# EAGLE design motor_ctrl_pw_v1 (EAGLE 6.5.0)
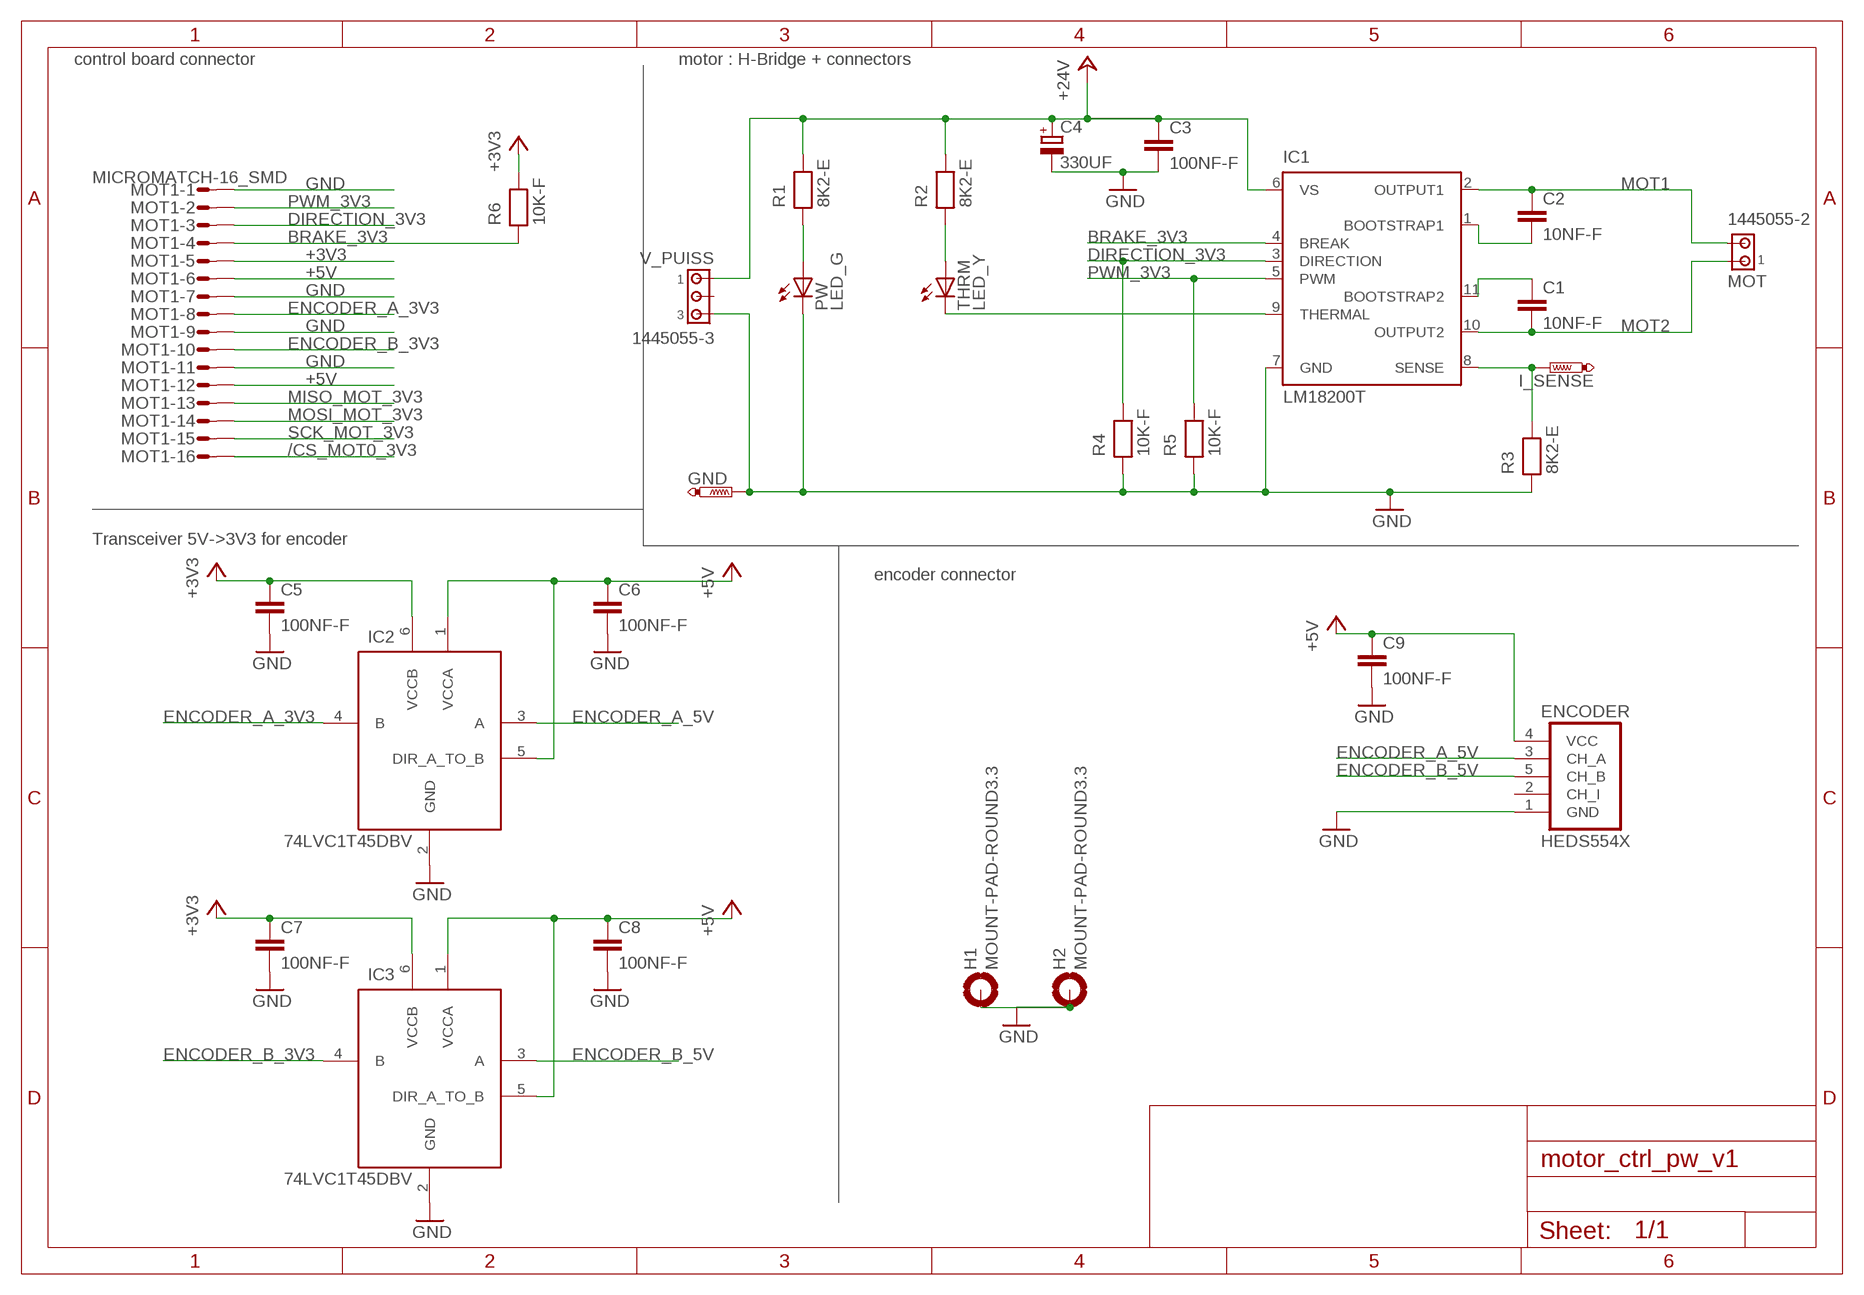
[diagram p0: schematic, sheet 1]

## Parts
C1  10NF-F  [C0603]
C2  10NF-F  [C0603]
C3  100NF-F  [C0603]
C4  330UF  [PANASONIC_G]
C5  100NF-F  [C0603]
C6  100NF-F  [C0603]
C7  100NF-F  [C0603]
C8  100NF-F  [C0603]
C9  100NF-F  [C0603]
ENCODER  HEDS554X  [22-05-1052]
GND  PTR1PAD1-13  [P1-13]
H1  MOUNT-PAD-ROUND3.3  [3,3-PAD]
H2  MOUNT-PAD-ROUND3.3  [3,3-PAD]
I_SENSE  PTR1PAD1-13  [P1-13]
IC1  LM18200T  [TO-220-11]
IC2  74LVC1T45DBV  [SOT23-6]
IC3  74LVC1T45DBV  [SOT23-6]
MOT  1445055-2  [1445055-2]
MOT1  MICROMATCH-16_SMD  [MICROMATCH-16_SMD]
PW  LED_G  [CHIP-LED0805]
R1  8K2-E  [R0805]
R2  8K2-E  [R0805]
R3  8K2-E  [R0805]
R4  10K-F  [R0603]
R5  10K-F  [R0603]
R6  10K-F  [R0603]
THRM  LED_Y  [CHIP-LED0805]
V_PUISS  1445055-3  [1445055-3]

## Nets
+3V3: C5.1 C7.1 IC2.6(VCCB) IC3.6(VCCB) MOT1.5 R6.2
+5V: C6.1 C8.1 C9.1 ENCODER.4(VCC) IC2.1(VCCA) IC2.5(DIR_A_TO_B) IC3.1(VCCA) IC3.5(DIR_A_TO_B) MOT1.6 MOT1.12
+24V: C3.1 C4.+ IC1.6(VS) R1.2 R2.2 V_PUISS.1
/CS_MOT0_3V3: MOT1.16
BRAKE_3V3: IC1.4(BREAK) MOT1.4 R6.1
DIRECTION_3V3: IC1.3(DIRECTION) MOT1.3 R4.2
ENCODER_A_3V3: IC2.4(B) MOT1.8
ENCODER_A_5V: ENCODER.3(CH_A) IC2.3(A)
ENCODER_B_3V3: IC3.4(B) MOT1.10
ENCODER_B_5V: ENCODER.5(CH_B) IC3.3(A)
GND: C3.2 C4.- C5.2 C6.2 C7.2 C8.2 C9.2 ENCODER.1(GND) GND.TP H1.B3,3(MOUNT) H2.B3,3(MOUNT) IC1.7(GND) IC2.2(GND) IC3.2(GND) MOT1.1 MOT1.7 MOT1.9 MOT1.11 PW.C R3.1 R4.1 R5.1 V_PUISS.3
MISO_MOT_3V3: MOT1.13
MOSI_MOT_3V3: MOT1.14
MOT1: C2.1 IC1.2(OUTPUT1) MOT.2
MOT2: C1.2 IC1.10(OUTPUT2) MOT.1
N$1: R2.1 THRM.A
N$2: I_SENSE.TP IC1.8(SENSE) R3.2
N$3: PW.A R1.1
N$4: IC1.9(THERMAL) THRM.C
N$5: C2.2 IC1.1(BOOTSTRAP1)
N$6: C1.1 IC1.11(BOOTSTRAP2)
PWM_3V3: IC1.5(PWM) MOT1.2 R5.2
SCK_MOT_3V3: MOT1.15
Unconnected: ENCODER.2(CH_I) V_PUISS.2

## Notes on the sheet
- control board connector | motor : H-Bridge + connectors
- Transceiver 5V->3V3 for encoder
- encoder connector

## Library data of the parts
C1 C2 = robotter_capacitor:10NF; MOUSER: 81-GCM188R71H103KA7D; RS: 723-4982; VALUE: 10nF 50V
C3 C5-C9 = robotter_capacitor:100NF; MOUSER: 81-GRM188F51H104ZA01; RS: 723-5534; VALUE: 100nF 50V
C4 = robotter_capacitor:330UF; MANUFACTURER: EEEFK1V331P; MOUSER: 667-EEE-FK1V331P; RS: 708-3475; VALUE: 330µF 35V
ENCODER = robotter_connector:HEDS554X; FARNELL: 9732594; MOUSER: 538-22-05-1052; RS: 687-7275; VALUE: 22-05-1052
GND I_SENSE = testpad:PTR1: TEST PIN
H1 H2 = holes:MOUNT-PAD-ROUND: MOUNTING PAD, round
IC1 = robotter_ic:LM18200T: 3A, 55V H-Bridge Motor Control SourcE: http://cache.national.com/ds/LM/LMD18200.pdf; FARNELL: 1468979; MOUSER: 926-LMD18200T/NOPB; RS: 534-4276
IC2 IC3 = robotter_ic:74LVC1T45; MOUSER: 595-SN74LVC1T45DBVT; RS: 662-8825
MOT = robotter_connector:1445055-2: Micro MATE-N-LOK Connectors grid 1.5 mm Source: ENG_CD_1445055_A.pdf; MOUSER: 571-2-1445055-2; RS: 495-9580
MOT1 = robotter_connector:MICROMATCH-16_SMD: MicroMaTch 16 FN : 1565592 / 8-215464-6 / 1-215464-6 Drawing Number C-215464 DDEController.pdf; MOUSER: 571-8-188275-6; RS: 739-1237
PW = robotter_diode:LED_; MOUSER: 859-LTST-C171GKT; RS: 692-0935; VALUE: GREEN
R1-R3 = robotter_resistor:8K2; MOUSER: 71-CRCW08058K20FKEB; RS: 679-1727
R4-R6 = robotter_resistor:10K; MOUSER: 652-CR0603-JW-103ELF; RS: 740-8899
THRM = robotter_diode:LED_; MOUSER: 859-LTST-C170YKT; RS: 692-0925; VALUE: YELLOW
V_PUISS = robotter_connector:1445055-3: Micro MATE-N-LOK Connectors grid 1.5 mm Source: ENG_CD_1445055_A.pdf; FARNELL: 1111119; MOUSER: 571-2-1445055-3; RS: 495-9596

## Board
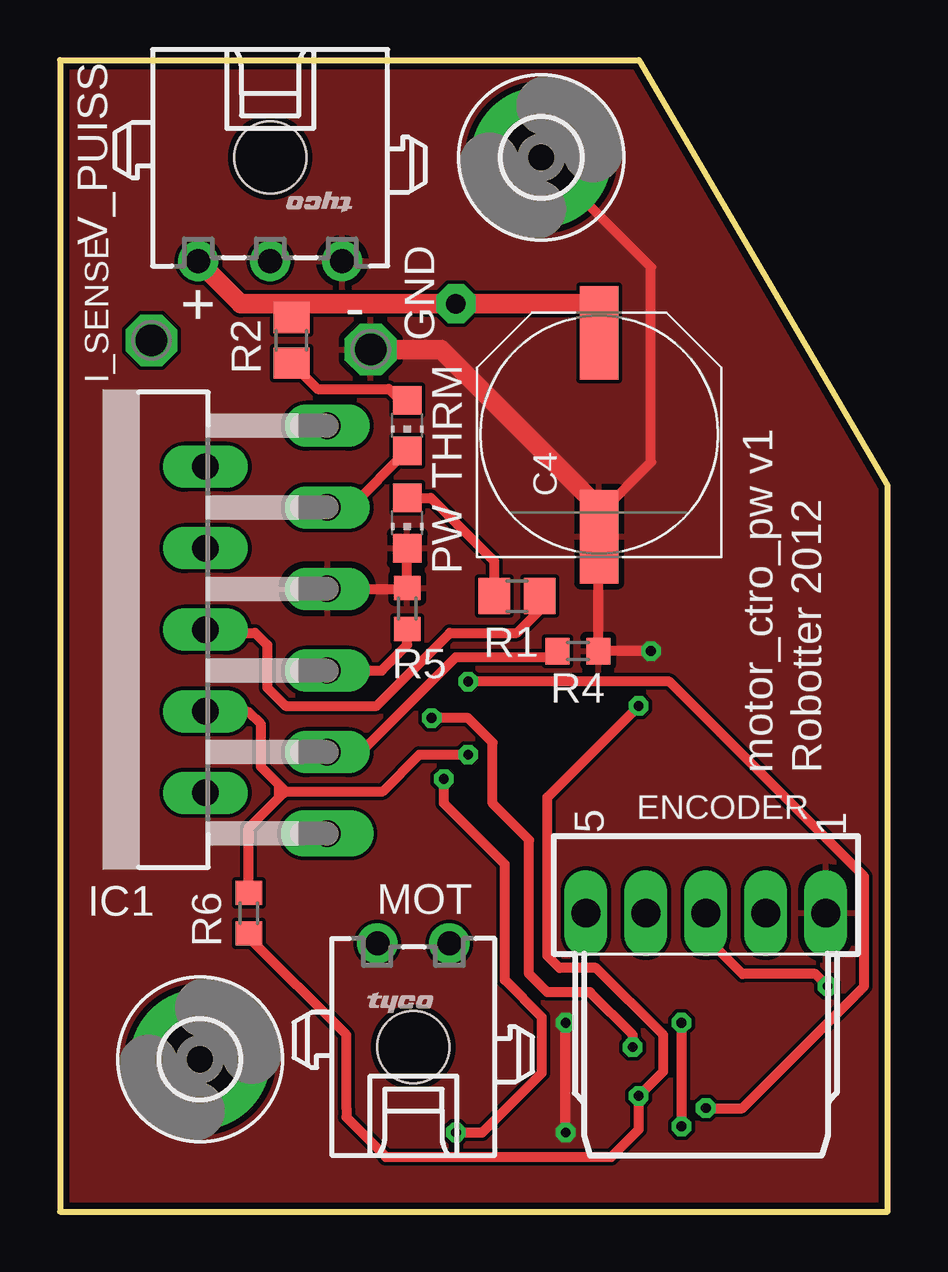
[diagram p1: board, top side]
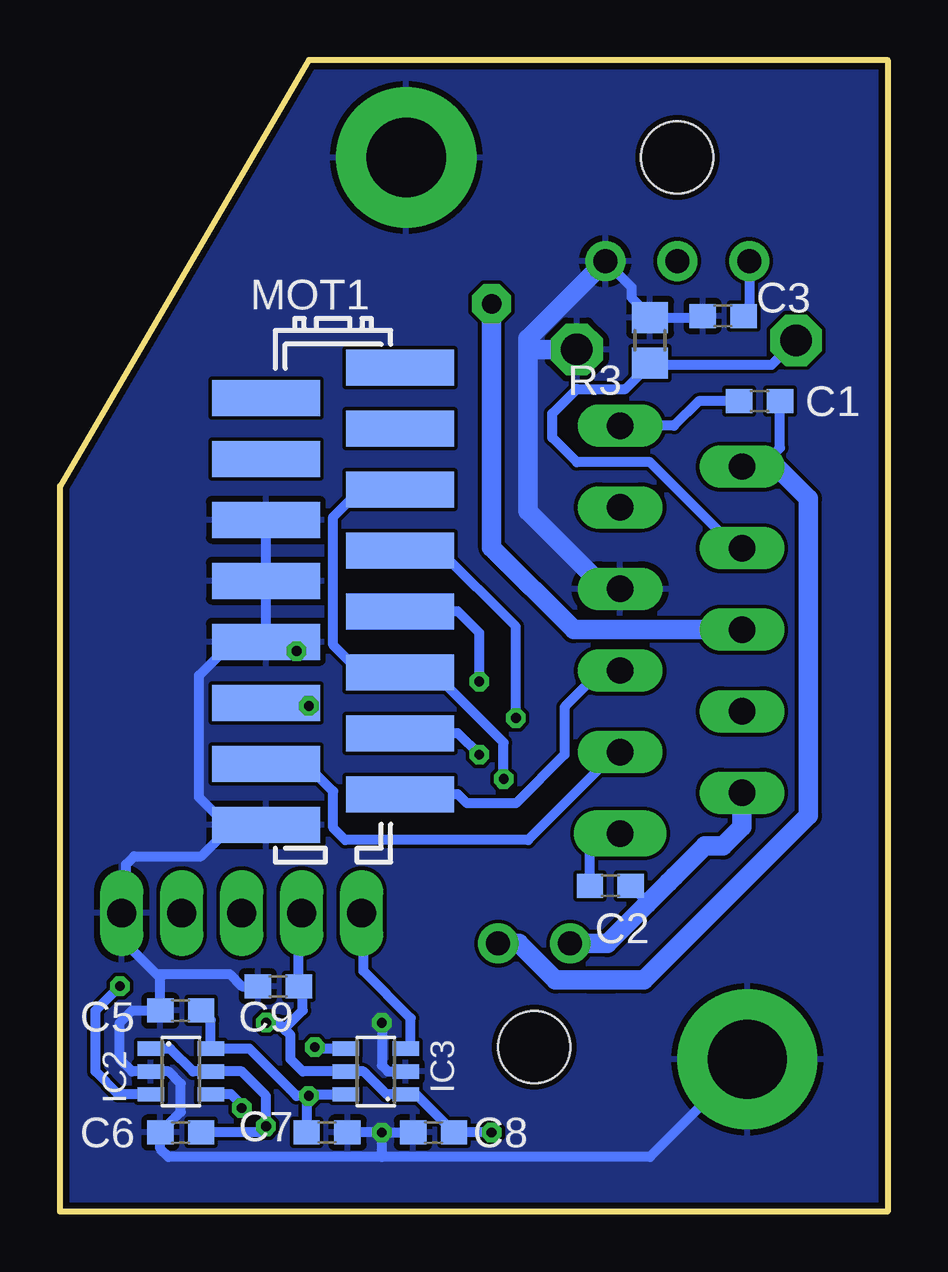
[diagram p2: board, bottom side, seen from below]

Size 34.5 x 48.01 mm. Coordinates in mm from the lower left corner, seen from the top.
Outline: 0,48 24.13,48 34.5,30.25 34.5,0 0,0 0,48.01
Copper layers (1*16): Top 0.035mm / dielectric 1.5mm / Bottom 0.035mm
Design rules "Fusion_eagle_rule_v1.1": minimum track width 6mil, minimum drill 12mil, track to track 6mil, track to pad 6mil, pad to pad 6mil, via to via 6mil, smd to smd 0mil, copper to edge 10mil, drill to drill 10mil, minimum pad ring 10mil, minimum via ring 6mil, stop-mask expansion 2mil, vias tented up to drill 100mil, thermal gap 10mil

### Footprints (pad centres in the part's own frame; a part is rotated, then mirrored left to right if it is on the bottom)
C0603 = smd 1.1 x 1: 1 -0.85,0; 2 0.85,0
PANASONIC_G = smd 3.9 x 1.6: + 4.25,0; - -4.25,0
22-05-1052 = drill 1.2 long: 1 5,0; 2 2.5,0; 3 0,0; 4 -2.5,0; 5 -5,0
P1-13 = drill 1.321 pad 2.159 octagon: TP 0,0
3,3-PAD = drill 3.3 pad 5.842: B3,3 0,0
TO-220-11 = drill 1.1 pad 1.93 long: 1 -8.5,-9.37 | drill 1.1 pad 1.778 long: 2 -6.8,-4.29; 3 -5.1,-9.37; 4 -3.4,-4.29; 5 -1.7,-9.37; 6 0,-4.29; 7 1.7,-9.37; 8 3.4,-4.29; 9 5.1,-9.37; 10 6.8,-4.29; 11 8.5,-9.37
SOT23-6 = smd 0.6 x 1.1: 1 -0.95,-1.25; 2 0,-1.25; 3 0.95,-1.25; 4 0.95,1.25; 5 0,1.25; 6 -0.95,1.25
1445055-2 = drill 1 pad 1.676: 1 1.5,4.32; 2 -1.5,4.32 | hole 3: 0,0
MICROMATCH-16_SMD = smd 1.5 x 4.5: 1 9.525,-2.794; 2 8.255,2.794; 3 6.985,-2.794; 4 5.715,2.794; 5 4.445,-2.794; 6 3.175,2.794; 7 1.905,-2.794; 8 0.635,2.794; 9 -0.635,-2.794; 10 -1.905,2.794; 11 -3.175,-2.794; 12 -4.445,2.794; 13 -5.715,-2.794; 14 -6.985,2.794; 15 -8.255,-2.794; 16 -9.525,2.794
CHIP-LED0805 = smd 1.2 x 1.2: A 0,-1.05; C 0,1.05
R0805 = smd 1.3 x 1.5: 1 -0.95,0; 2 0.95,0
R0603 = smd 1 x 1.1: 1 -0.85,0; 2 0.85,0
1445055-3 = drill 1 pad 1.676: 1 3,4.32; 2 0,4.32; 3 -3,4.32 | hole 3: 0,0

### Placement (x,y rotation side)
C1  5.33,33.78 0 bottom
C2  11.56,13.59 180 bottom
C3  6.86,37.34 180 bottom
C4  22.48,32.38 90 top
C5  29.46,8.38 180 bottom
C6  29.46,3.3 180 bottom
C7  23.37,3.3 0 bottom
C8  18.92,3.3 180 bottom
C9  25.4,9.4 180 bottom
ENCODER  26.92,12.45 0 top
GND  12.95,35.94 0 top
H1  20.07,43.94 0 top
H2  5.84,6.35 0 top
I_SENSE  3.81,36.32 0 top
IC1  1.78,24.26 90 top
IC2  29.46,5.84 270 bottom
IC3  21.34,5.84 90 bottom
MOT  14.73,6.86 0 top
MOT1  23.11,25.65 270 bottom
PW  14.48,28.7 180 top
R1  19.05,25.65 0 top
R2  9.65,36.32 90 top
R3  9.91,36.32 270 bottom
R4  21.59,23.37 180 top
R5  14.48,25.15 270 top
R6  7.87,12.45 270 top
THRM  14.48,32.77 180 top
V_PUISS  8.76,43.94 180 top

### Tracks (layer width: path | path; a pad name or v marks a point on that pad's centre or on a via)
+3V3  (via drill 0.41 pad 0.81)
  Top 0.406: R6.2 7.87,11.43 11.94,7.37 11.94,4.32 11.94,3.94 13.59,2.29 22.99,2.29 24.13,3.43 v24.13,4.83 25.15,5.84 25.15,7.37 22.35,10.16 20.83,10.16 20.32,10.67 20.32,17.27 v24.13,21.08
  Bottom 0.406: C5.1 28.21,7.98 IC2.6 26.6,6.79 24.64,4.83 v24.13,4.83 24.16,4.86 | v24.13,21.08 25.78,21.08 MOT1.5 | IC3.6 24.13,4.89 24.16,4.86 | C7.1 24.22,4.8 24.16,4.86
+5V  (via drill 0.41 pad 0.81)
  Top 0.406: v16,18.03 16,17.02 18.54,14.48 18.54,9.65 20.09,8.11 20.09,5.78 17.61,3.3 v16.51,3.3 | v25.91,7.87 v25.91,3.56
  Bottom 0.406: IC2.1 29.91,6.79 28.96,5.84 IC2.5 26.92,5.84 25.91,4.83 v25.91,3.56 26.16,3.3 C6.1 | MOT1.12 21.97,30.1 23.11,28.96 23.11,23.62 21.97,22.48 MOT1.6 18.92,22.48 16,19.56 v16,18.03 | ENCODER.4 24.55,12.32 C9.1 24.38,9.4 24.38,8.38 25.15,7.62 | 25.15,7.62 24.89,7.37 24.89,6.35 24.38,5.84 IC3.5 21.84,5.84 20.89,4.89 IC3.1 19.66,4.89 C8.1 v16.51,3.3 | 25.15,7.62 25.4,7.87 v25.91,7.87
+24V  (via drill 0.81 pad 1.63)
  Top 0.406: v16.51,37.85 16.26,38.1 | R1.2 20,25.08 19.05,24.13 16.26,24.13 13.21,21.08 9.4,21.08 8.64,21.84 8.64,23.62 8.13,24.13 6.2,24.13 IC1.6 | 9.91,37.34 9.91,37.59 9.65,37.85 | 10.16,37.85 10.16,37.78 R2.2
  Top 0.813: 9.53,37.85 9.65,37.85 10.16,37.85 v16.51,37.85 21.84,37.85 22.48,37.21 C4.+ | 9.53,37.85 7.54,37.85 V_PUISS.1 | 9.91,37.34 9.91,37.47 9.53,37.85
  Bottom 0.406: V_PUISS.1 5.76,37.58 C3.1
  Bottom 0.813: IC1.6 13.08,24.26 16.51,27.69 v16.51,37.85
BRAKE_3V3  (via drill 0.41 pad 0.81)
  Top 0.406: IC1.4 6.1,20.83 7.87,20.83 8.38,20.32 8.38,18.54 9.14,17.78 | R6.1 7.87,16 9.14,17.27 | 9.14,17.27 9.4,17.53 | 9.4,17.53 13.46,17.53 14.99,19.05 v17.02,19.05 | 9.4,17.53 9.14,17.78 | 9.14,17.27 9.14,17.78
  Bottom 0.406: MOT1.4 17.91,19.94 v17.02,19.05
DIRECTION_3V3
  Top 0.406: IC1.3 12.55,19.16 16.51,23.11 20.49,23.11 arc90 R4.2
  Bottom 0.406: IC1.3 11.32,19.16 14.99,15.49 22.61,15.49 23.11,16 23.11,17.53 24.26,18.67 MOT1.3
ENCODER_A_3V3  (via drill 0.41 pad 0.81)
  Top 0.406: v17.02,22.1 25.4,22.1 33.53,13.97 33.53,9.4 28.45,4.32 v26.92,4.32
  Bottom 0.406: MOT1.8 17.91,25.02 17.02,24.13 v17.02,22.1 | IC2.4 27.37,4.89 26.92,4.45 v26.92,4.32
ENCODER_A_5V  (via drill 0.41 pad 0.81)
  Top 0.406: ENCODER.3 26.92,11.43 28.45,9.91 31.5,9.91 v32,9.4
  Bottom 0.406: v32,9.4 33.02,8.38 33.02,5.84 32.07,4.89 IC2.3
ENCODER_B_3V3  (via drill 0.41 pad 0.81)
  Top 0.406: v15.49,20.57 17.02,20.57 18.03,19.56 18.03,17.02 19.56,15.49 19.56,9.91 20.32,9.14 22.1,9.14 23.88,7.37 v23.88,6.86
  Bottom 0.406: v15.49,20.57 15.49,24.38 18.67,27.56 MOT1.10 | IC3.4 23.81,6.79 v23.88,6.86
ENCODER_B_5V
  Bottom 0.406: IC3.3 19.88,6.79 19.88,8.06 21.84,10.03 21.84,12.37 ENCODER.5
GND  (via drill 0.41 pad 0.81)
  Top 0.406: IC1.7 14.31,25.96 14.35,26 R5.1 PW.C | H1.B3,3 24.64,39.37 24.64,31.24 22.61,29.21 | v21.08,3.3 v21.08,7.87 | v24.64,23.37 R4.1 22.44,28.1 C4.-
  Top 0.813: GND.TP 15.88,35.94 22.61,29.21 22.61,28.26 C4.-
  Bottom 0.406: MOT1.11 MOT1.9 MOT1.7 25.53,23.37 v24.64,23.37 27.69,23.37 28.7,22.35 28.7,17.27 27.43,16 | 11.68,39.62 V_PUISS.3 10.67,38.53 10.67,38.1 9.91,37.34 R3.1 7.77,37.27 C3.2 | IC3.2 20.83,5.84 21.08,6.1 v21.08,7.87 | C5.2 31.5,8.38 32,7.87 32,6.35 31.5,5.84 IC2.2 29.97,5.84 29.46,5.33 29.46,4.15 C6.2 30.31,2.63 29.97,2.29 21.08,2.29 | C9.2 26.92,9.4 27.43,9.91 30.48,9.91 | 30.48,9.91 31.92,11.35 ENCODER.1 31.75,12.62 31.75,14.48 31.42,14.81 28.62,14.81 27.43,16 | 30.48,8.64 30.48,8.55 C5.2 | v21.08,3.3 C8.2 | v21.08,3.3 C7.2 | 21.08,2.29 v21.08,3.3 | C5.2 30.31,9.74 30.48,9.91 | 27.43,16 25.91,16 MOT1.1 | 21.08,2.29 9.91,2.29 H2.B3,3
  Bottom 0.813: IC1.7 11.73,25.96 14.99,29.21 14.99,36.07 | 14.99,36.07 14.99,36.4 V_PUISS.3 | GND.TP 14.86,35.94 14.99,36.07
  pour Top: 0,48.01 0,0 34.54,0 34.54,30.23 24.13,48.01
  pour Bottom: 0,0 34.54,0 34.54,30.23 24.64,48.01 0,48.01
MOT1
  Bottom 0.406: 9.14,13.72 9.27,13.59 | C2.1 10.03,12.91 10.03,12.83
  Bottom 0.813: 12.95,11.18 MOT.2 11.68,11.18 10.03,12.83 9.14,13.72 | 9.14,13.72 8.89,13.97 | IC1.2 6.07,16.03 6.86,15.24 7.62,15.24 9.14,13.72
MOT2
  Bottom 0.406: C1.2 4.48,31.84 5.26,31.06 IC1.10
  Bottom 0.813: IC1.10 4.64,31.06 3.3,29.72 3.3,16.51 10.16,9.65 12.45,9.65 | 16.23,10.9 MOT.1 15.37,11.18 13.84,9.65 12.45,9.65 | 12.45,9.65 11.43,9.65
N$1
  Top 0.406: R2.1 10.73,34.29 13.72,34.29 14.19,33.82 THRM.A
N$2
  Bottom 0.406: IC1.8 6.32,27.66 9.91,31.24 12.95,31.24 13.97,32.26 13.97,33.27 12.95,34.29 10.92,34.29 9.91,35.31 | I_SENSE.TP 4.83,35.31 9.91,35.31 | 9.46,35.37 R3.2 9.91,35.31
N$3
  Top 0.406: PW.A 15.46,29.75 18.1,27.11 R1.1
N$4
  Top 0.406: IC1.9 12.12,29.36 THRM.C
N$5
  Bottom 0.406: C2.2 12.41,15.03 11.68,15.76 IC1.1
N$6
  Bottom 0.406: IC1.11 8.9,32.76 7.87,33.78 C1.1
PWM_3V3
  Top 0.406: R5.2 14.48,23.62 13.41,22.56 IC1.5
  Bottom 0.406: IC1.5 11.94,22.56 13.46,21.03 13.46,19.05 15.49,17.02 17.53,17.02 17.91,17.4 MOT1.2

### Text on the board
tNames: - | + | motor_ctro_pw v1 | Robotter 2012